# EAGLE board freetserv (EAGLE 7.5.0), part 1 of 2
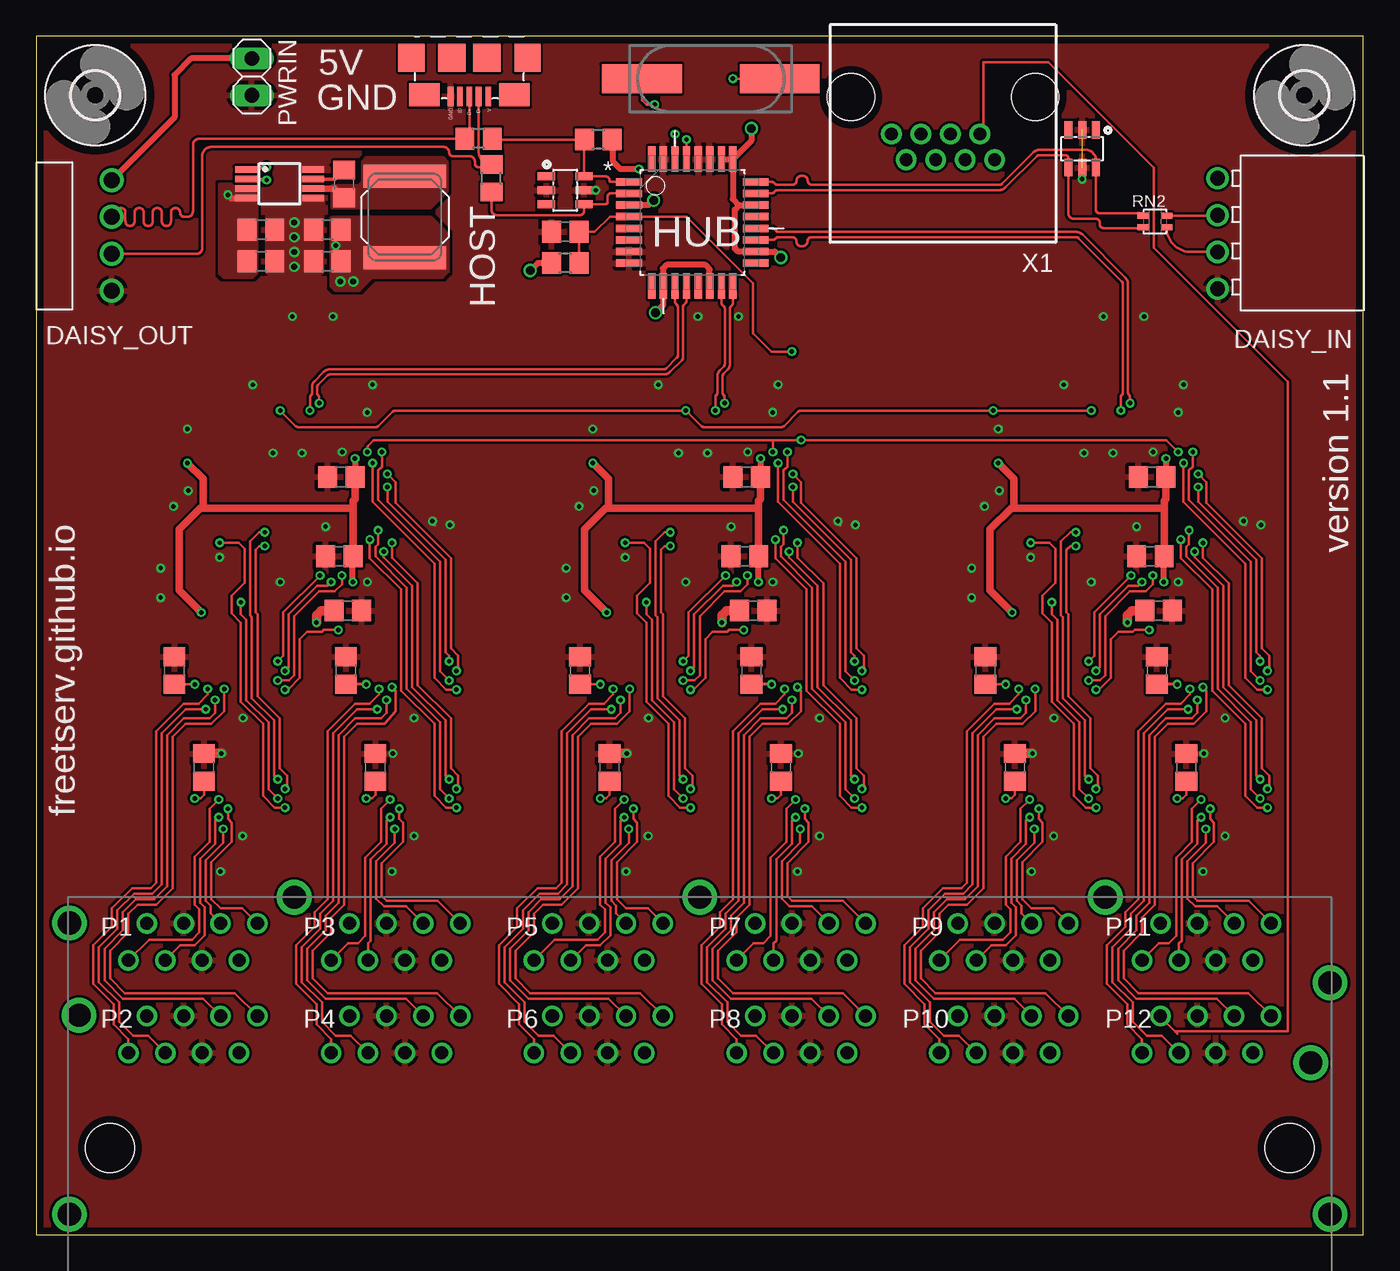
[diagram p7: board, top side]
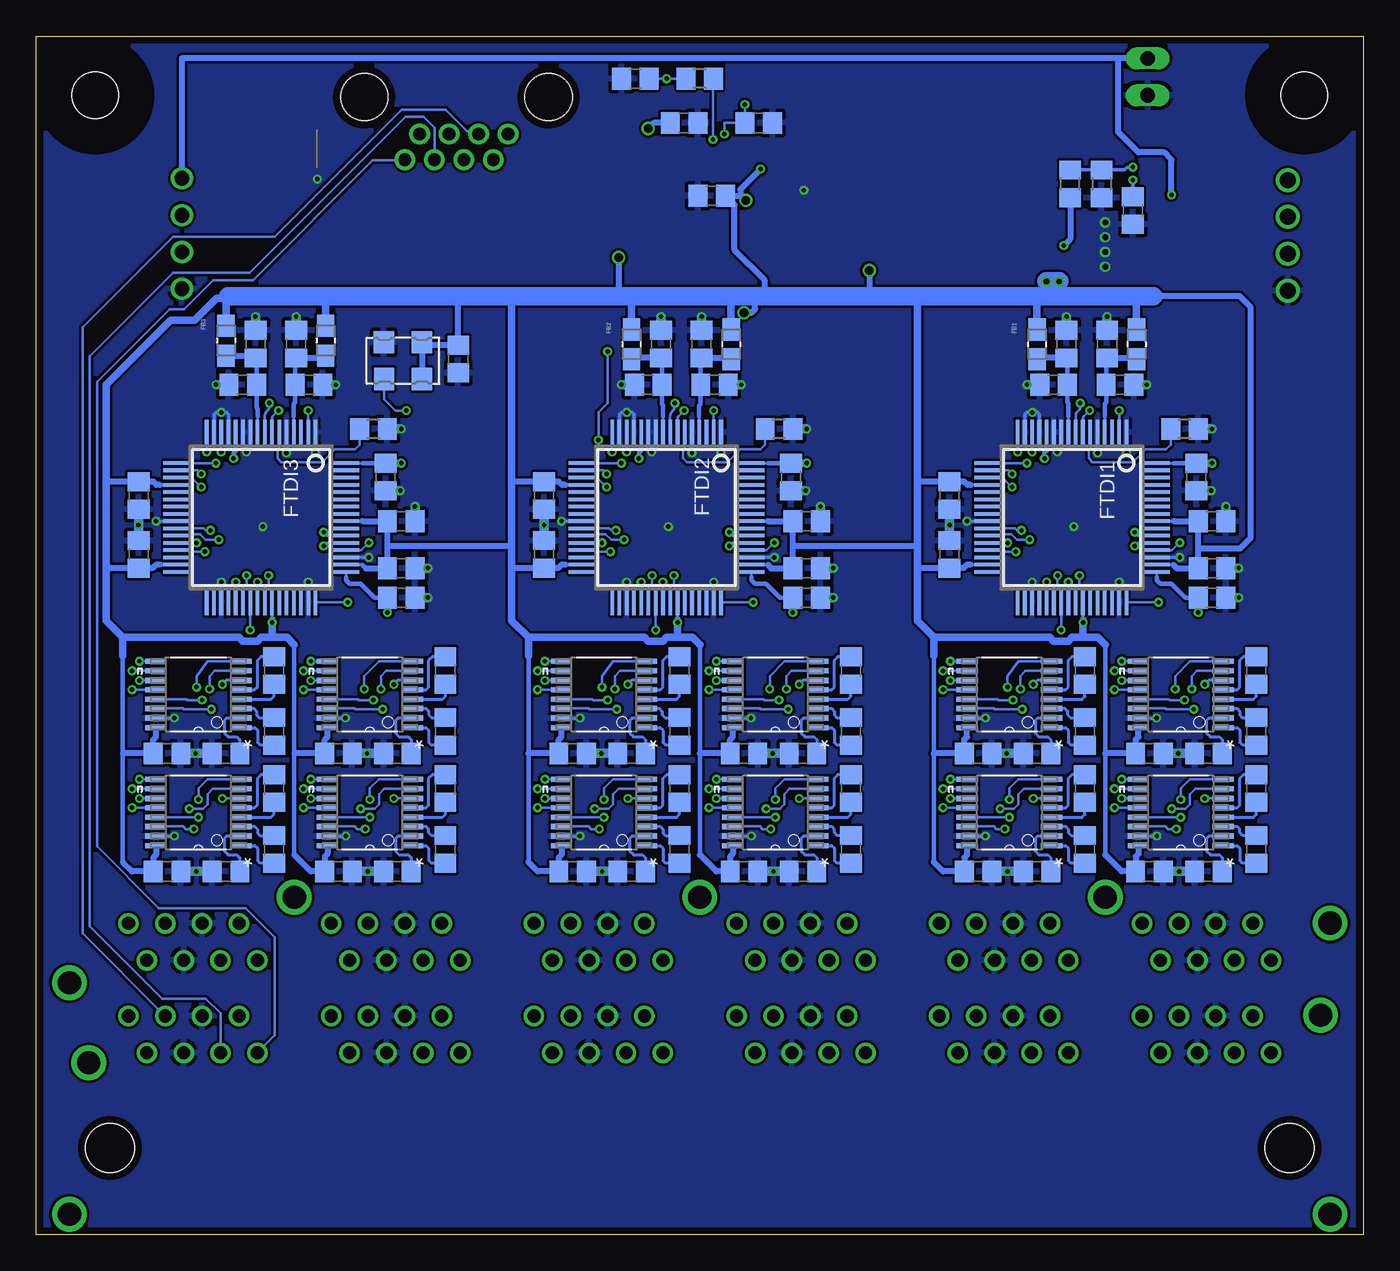
[diagram p8: board, bottom side, seen from below]

Size 91.44 x 82.55 mm. Coordinates in mm from the lower left corner, seen from the top.
Outline: 0,0 91.44,0 91.44,82.55 0,82.55 0,0
Copper layers (1*16): Top 0.035mm / dielectric 1.5mm / Bottom 0.035mm
Design rules "EagleRules": minimum track width 7mil, minimum drill 12mil, track to track 7mil, track to pad 7mil, pad to pad 7mil, via to via 7mil, smd to smd 0mil, copper to edge 20mil, drill to drill 10mil, minimum pad ring 10mil, minimum via ring 6mil, stop-mask expansion 2mil, vias tented up to drill 25mil, thermal gap 10mil
Net classes: 1 USB: width 0.178 mm, clearance 0.178 mm; 2 power: width 0.406 mm

## Footprints (pad centres in the part's own frame; a part is rotated, then mirrored left to right if it is on the bottom)
C0805 = smd 1.3 x 1.5: 1 -0.95,0; 2 0.95,0
SOT23-6 = smd 0.55 x 1.2: 1 -0.95,-1.3; 2 0,-1.3; 3 0.95,-1.3; 4 0.95,1.3; 5 0,1.3; 6 -0.95,1.3
613004143121 = drill 1.02: 1 0,0; 2 2.54,0; 3 5.08,0; 4 7.62,0
61300411021 = drill 1.1: 1 3.81,0; 2 1.27,0; 3 -1.27,0; 4 -3.81,0
WE-KI_0805A = smd 1.524 x 1.2: 1 -1.015,0; 2 1.041,0
LQFP64 = smd 0.25 x 1.778: 1 -3.75,-5.854; 2 -3.25,-5.854; 3 -2.75,-5.854; 4 -2.25,-5.854; 5 -1.75,-5.854; 6 -1.25,-5.854; 7 -0.75,-5.854; 8 -0.25,-5.854; 9 0.25,-5.854; 10 0.75,-5.854; 11 1.25,-5.854; 12 1.75,-5.854; 13 2.25,-5.854; 14 2.75,-5.854; 15 3.25,-5.854; 16 3.75,-5.854; 33 3.75,5.854; 34 3.25,5.854; 35 2.75,5.854; 36 2.25,5.854; 37 1.75,5.854; 38 1.25,5.854; 39 0.75,5.854; 40 0.25,5.854; 41 -0.25,5.854; 42 -0.75,5.854; 43 -1.25,5.854; 44 -1.75,5.854; 45 -2.25,5.854; 46 -2.75,5.854; 47 -3.25,5.854; 48 -3.75,5.854 | smd 1.778 x 0.25: 17 5.854,-3.75; 18 5.854,-3.25; 19 5.854,-2.75; 20 5.854,-2.25; 21 5.854,-1.75; 22 5.854,-1.25; 23 5.854,-0.75; 24 5.854,-0.25; 25 5.854,0.25; 26 5.854,0.75; 27 5.854,1.25; 28 5.854,1.75; 29 5.854,2.25; 30 5.854,2.75; 31 5.854,3.25; 32 5.854,3.75; 49 -5.854,3.75; 50 -5.854,3.25; 51 -5.854,2.75; 52 -5.854,2.25; 53 -5.854,1.75; 54 -5.854,1.25; 55 -5.854,0.75; 56 -5.854,0.25; 57 -5.854,-0.25; 58 -5.854,-0.75; 59 -5.854,-1.25; 60 -5.854,-1.75; 61 -5.854,-2.25; 62 -5.854,-2.75; 63 -5.854,-3.25; 64 -5.854,-3.75
3,2 = hole 3.2: 0,0
QFP80P900X900X145-32N = smd 1.778 x 0.508: 1 -4.369,2.794; 2 -4.369,2.007; 3 -4.369,1.194; 4 -4.369,0.406; 5 -4.369,-0.406; 6 -4.369,-1.194; 7 -4.369,-2.007; 8 -4.369,-2.794; 17 4.369,-2.794; 18 4.369,-2.007; 19 4.369,-1.194; 20 4.369,-0.406; 21 4.369,0.406; 22 4.369,1.194; 23 4.369,2.007; 24 4.369,2.794 | smd 0.508 x 1.778: 9 -2.794,-4.369; 10 -2.007,-4.369; 11 -1.194,-4.369; 12 -0.406,-4.369; 13 0.406,-4.369; 14 1.194,-4.369; 15 2.007,-4.369; 16 2.794,-4.369; 25 2.794,4.369; 26 2.007,4.369; 27 1.194,4.369; 28 0.406,4.369; 29 -0.406,4.369; 30 -1.194,4.369; 31 -2.007,4.369; 32 -2.794,4.369
MSOP8 = smd 0.45 x 1.524: 1 -0.975,-2.304; 2 -0.325,-2.304; 3 0.325,-2.304; 4 0.975,-2.304; 5 0.975,2.304; 6 0.325,2.304; 7 -0.325,2.304; 8 -0.975,2.304
SOP65P640X120-16N = smd 1.473 x 0.356: 1 -2.921,2.286; 2 -2.921,1.626; 3 -2.921,0.965; 4 -2.921,0.33; 5 -2.921,-0.33; 6 -2.921,-0.965; 7 -2.921,-1.626; 8 -2.921,-2.286; 9 2.921,-2.286; 10 2.921,-1.626; 11 2.921,-0.965; 12 2.921,-0.33; 13 2.921,0.33; 14 2.921,0.965; 15 2.921,1.626; 16 2.921,2.286
NR60XX = smd 1.6 x 5.7: 1 -2.8,0; 2 2.8,0
1X02 = drill 1.016 long: 1 -1.27,0; 2 1.27,0
CSM-7X-DU = smd 5.5 x 2: 1 -4.75,0; 2 4.75,0
XO53 = smd 1.4 x 1.524: 1 -1.3,-1.278; 2 1.325,-1.278; 3 1.3,1.252; 4 -1.3,1.252
R0805 = smd 1.3 x 1.5: 1 -0.95,0; 2 0.95,0
EXBV4V = smd 0.4 x 0.8: A1 -0.4,-0.8; A2 -0.4,0.8; B1 0.4,-0.8; B2 0.4,0.8
SS73100-046F = drill 1.6 pad 2.1: H1 -43.434,-4.572; H2 -42.774,9.144; H3 -43.434,15.494; H4 -27.94,17.272; H5 0,17.272; H6 27.94,17.272; H7 43.434,11.379; H8 42.113,5.867; H9 43.434,-4.572 | drill 0.9 pad 1.4: P1.1 -30.48,15.469; P1.2 -31.75,12.929; P1.3 -33.02,15.469; P1.4 -34.29,12.929; P1.5 -35.56,15.469; P1.6 -36.83,12.929; P1.7 -38.1,15.469; P1.8 -39.37,12.929; P2.1 -39.37,6.553; P2.2 -38.1,9.093; P2.3 -36.83,6.553; P2.4 -35.56,9.093; P2.5 -34.29,6.553; P2.6 -33.02,9.093; P2.7 -31.75,6.553; P2.8 -30.48,9.093; P3.1 -16.51,15.469; P3.2 -17.78,12.929; P3.3 -19.05,15.469; P3.4 -20.32,12.929; P3.5 -21.59,15.469; P3.6 -22.86,12.929; P3.7 -24.13,15.469; P3.8 -25.4,12.929; P4.1 -25.4,6.553; P4.2 -24.13,9.093; P4.3 -22.86,6.553; P4.4 -21.59,9.093; P4.5 -20.32,6.553; P4.6 -19.05,9.093; P4.7 -17.78,6.553; P4.8 -16.51,9.093; P5.1 -2.54,15.469; P5.2 -3.81,12.929; P5.3 -5.08,15.469; P5.4 -6.35,12.929; P5.5 -7.62,15.469; P5.6 -8.89,12.929; P5.7 -10.16,15.469; P5.8 -11.43,12.929; P6.1 -11.43,6.553; P6.2 -10.16,9.093; P6.3 -8.89,6.553; P6.4 -7.62,9.093; P6.5 -6.35,6.553; P6.6 -5.08,9.093; P6.7 -3.81,6.553; P6.8 -2.54,9.093; P7.1 11.43,15.469; P7.2 10.16,12.929; P7.3 8.89,15.469; P7.4 7.62,12.929; P7.5 6.35,15.469; P7.6 5.08,12.929; P7.7 3.81,15.469; P7.8 2.54,12.929; P8.1 2.54,6.553; P8.2 3.81,9.093; P8.3 5.08,6.553; P8.4 6.35,9.093; P8.5 7.62,6.553; P8.6 8.89,9.093; P8.7 10.16,6.553; P8.8 11.43,9.093; P9.1 25.4,15.469; P9.2 24.13,12.929; P9.3 22.86,15.469; P9.4 21.59,12.929; P9.5 20.32,15.469; P9.6 19.05,12.929; P9.7 17.78,15.469; P9.8 16.51,12.929; P10.1 16.51,6.553; P10.2 17.78,9.093; P10.3 19.05,6.553; P10.4 20.32,9.093; P10.5 21.59,6.553; P10.6 22.86,9.093; P10.7 24.13,6.553; P10.8 25.4,9.093; P11.1 39.37,15.469; P11.2 38.1,12.929; P11.3 36.83,15.469; P11.4 35.56,12.929; P11.5 34.29,15.469; P11.6 33.02,12.929; P11.7 31.75,15.469; P11.8 30.48,12.929; P12.1 30.48,6.553; P12.2 31.75,9.093; P12.3 33.02,6.553; P12.4 34.29,9.093; P12.5 35.56,6.553; P12.6 36.83,9.093; P12.7 38.1,6.553; P12.8 39.37,9.093 | hole 3.353: -40.64,0; 40.64,0
USB_MICROB_PACKAGE = smd 0.4 x 1.35: D+ 0,-0.68; D- -0.64,-0.68; GND 1.3,-0.68; ID 0.66,-0.68; V -1.3,-0.68 | smd 2.1 x 1.6: PAD1 -3.1,-0.8; PAD2 3.1,-0.8 | smd 1.8 x 1.9: PAD3 -4,-3.35; PAD6 4,-3.35 | smd 1.9 x 1.9: PAD4 -1.2,-3.35; PAD5 1.2,-3.35
0446200001 = drill 0.889 pad 1.422: 1 -3.556,4.318; 2 -2.54,2.54; 3 -1.524,4.318; 4 -0.508,2.54; 5 0.508,4.318; 6 1.524,2.54; 7 2.54,4.318; 8 3.556,2.54 | hole 3.251: 6.35,0; -6.35,0

## Placement (x,y rotation side)
C1  0.1uF  [C0805]  19.18,26.54 270 bottom
C2  10uF  [C0805]  15.49,69.22 0 top
C3  10uF  [C0805]  15.49,67.06 0 top
C4  0.1uF  [C0805]  21.21,72.39 270 top
C5  1uF  [C0805]  15.88,70.55 270 bottom
C6  10uF  [C0805]  20.07,69.22 180 top
C7  10uF  [C0805]  20.07,67.06 180 top
C8  3.3uF  [C0805]  10.41,43.88 180 bottom
C11  0.1uF  [C0805]  16.76,58.55 0 bottom
C12  0.1uF  [C0805]  21.34,58.55 180 bottom
C13  4.7uF  [C0805]  17.65,61.34 90 bottom
C14  4.7uF  [C0805]  20.45,61.34 90 bottom
C15  0.1uF  [C0805]  19.18,34.67 270 bottom
C16  0.1uF  [C0805]  19.18,38.86 270 bottom
C17  0.1uF  [C0805]  22.48,33.15 0 bottom
C18  0.1uF  [C0805]  21.34,38.86 270 top
C19  0.1uF  [C0805]  26.54,33.15 180 bottom
C20  18pF  [C0805]  41.66,76.58 180 bottom
C21  18pF  [C0805]  50.16,79.63 0 bottom
C22  0.1uF  [C0805]  19.18,30.73 270 bottom
C23  0.1uF  [C0805]  22.48,25.02 0 bottom
C24  0.1uF  [C0805]  23.37,32.19 270 top
C25  0.1uF  [C0805]  26.54,25.02 180 bottom
C26  0.1uF  [C0805]  7.37,34.67 270 bottom
C27  0.1uF  [C0805]  7.37,38.86 270 bottom
C28  0.1uF  [C0805]  10.67,33.15 0 bottom
C29  0.1uF  [C0805]  9.53,38.86 270 top
C30  0.1uF  [C0805]  14.73,33.15 180 bottom
C31  0.1uF  [C0805]  7.37,26.54 270 bottom
C32  0.1uF  [C0805]  7.37,30.73 270 bottom
C33  0.1uF  [C0805]  10.67,25.02 0 bottom
C34  0.1uF  [C0805]  11.56,32.19 270 top
C35  0.1uF  [C0805]  14.73,25.02 180 bottom
C36  0.1uF  [C0805]  46.8,76.58 180 bottom
C37  0.1uF  [C0805]  36.45,69.09 0 top
C38  0.1uF  [C0805]  21.02,52.2 180 top
C39  0.1uF  [C0805]  20.89,46.74 180 top
C40  0.1uF  [C0805]  11.49,52.2 270 bottom
C41  0.1uF  [C0805]  28.51,46.86 90 bottom
C42  0.1uF  [C0805]  28.51,50.93 270 bottom
C43  0.1uF  [C0805]  21.46,42.99 0 top
C44  0.1uF  [C0805]  10.41,49.15 0 bottom
C45  0.1uF  [C0805]  10.41,45.91 0 bottom
C46  0.1uF  [C0805]  44.89,71.56 0 bottom
C47  0.1uF  [C0805]  62.36,60.33 90 bottom
C53  4.7uF  [C0805]  48.39,61.34 90 bottom
C54  0.1uF  [C0805]  47.12,34.67 270 bottom
C55  0.1uF  [C0805]  47.12,38.86 270 bottom
C56  0.1uF  [C0805]  50.42,33.15 0 bottom
C57  0.1uF  [C0805]  49.28,38.86 270 top
C58  0.1uF  [C0805]  54.48,33.15 180 bottom
C59  0.1uF  [C0805]  48.96,52.2 180 top
C60  0.1uF  [C0805]  48.83,46.74 180 top
C61  0.1uF  [C0805]  39.43,52.2 270 bottom
C62  0.1uF  [C0805]  56.45,46.86 90 bottom
C63  0.1uF  [C0805]  56.45,50.93 270 bottom
C64  0.1uF  [C0805]  49.4,42.99 0 top
C65  0.1uF  [C0805]  38.35,49.15 0 bottom
C66  0.1uF  [C0805]  38.35,45.91 0 bottom
C67  0.1uF  [C0805]  47.12,26.54 270 bottom
C68  0.1uF  [C0805]  47.12,30.73 270 bottom
C69  0.1uF  [C0805]  50.42,25.02 0 bottom
C70  0.1uF  [C0805]  51.31,32.19 270 top
C71  0.1uF  [C0805]  54.48,25.02 180 bottom
C72  0.1uF  [C0805]  35.31,34.67 270 bottom
C73  0.1uF  [C0805]  35.31,38.86 270 bottom
C74  0.1uF  [C0805]  38.61,33.15 0 bottom
C75  0.1uF  [C0805]  37.47,38.86 270 top
C76  0.1uF  [C0805]  42.67,33.15 180 bottom
C77  0.1uF  [C0805]  35.31,26.54 270 bottom
C78  0.1uF  [C0805]  35.31,30.73 270 bottom
C79  0.1uF  [C0805]  38.61,25.02 0 bottom
C80  0.1uF  [C0805]  39.5,32.19 270 top
C81  0.1uF  [C0805]  42.67,25.02 180 bottom
C89  0.1uF  [C0805]  75.06,34.67 270 bottom
C90  0.1uF  [C0805]  75.06,38.86 270 bottom
C91  0.1uF  [C0805]  78.36,33.15 0 bottom
C92  0.1uF  [C0805]  77.22,38.86 270 top
C93  0.1uF  [C0805]  82.42,33.15 180 bottom
C94  0.1uF  [C0805]  76.9,52.2 180 top
C95  0.1uF  [C0805]  76.77,46.74 180 top
C96  0.1uF  [C0805]  67.37,52.2 270 bottom
C97  0.1uF  [C0805]  84.39,46.86 90 bottom
C98  0.1uF  [C0805]  84.39,50.93 270 bottom
C99  0.1uF  [C0805]  77.34,42.99 0 top
C100  0.1uF  [C0805]  66.29,49.15 0 bottom
C101  0.1uF  [C0805]  66.29,45.91 0 bottom
C102  0.1uF  [C0805]  75.06,26.54 270 bottom
C103  0.1uF  [C0805]  75.06,30.73 270 bottom
C104  0.1uF  [C0805]  78.36,25.02 0 bottom
C105  0.1uF  [C0805]  79.25,32.19 270 top
C106  0.1uF  [C0805]  82.42,25.02 180 bottom
C107  0.1uF  [C0805]  63.25,34.67 270 bottom
C108  0.1uF  [C0805]  63.25,38.86 270 bottom
C109  0.1uF  [C0805]  66.55,33.15 0 bottom
C110  0.1uF  [C0805]  65.41,38.86 270 top
C111  0.1uF  [C0805]  70.61,33.15 180 bottom
C112  0.1uF  [C0805]  63.25,26.54 270 bottom
C113  0.1uF  [C0805]  63.25,30.73 270 bottom
C114  0.1uF  [C0805]  66.55,25.02 0 bottom
C115  0.1uF  [C0805]  67.44,32.19 270 top
C116  0.1uF  [C0805]  70.61,25.02 180 bottom
C489  0.1uF  [C0805]  44.7,58.55 0 bottom
C502  4.7uF  [C0805]  45.59,61.34 90 bottom
C519  0.1uF  [C0805]  49.28,58.55 180 bottom
C629  3.3uF  [C0805]  38.35,43.88 180 bottom
C829  3.3uF  [C0805]  66.29,43.88 180 bottom
C859  0.1uF  [C0805]  72.64,58.55 0 bottom
C869  0.1uF  [C0805]  77.22,58.55 180 bottom
C879  4.7uF  [C0805]  73.53,61.34 90 bottom
C889  4.7uF  [C0805]  76.33,61.34 90 bottom
D1  SN65220  [SOT23-6]  36.45,71.95 270 top
D2  SN65220  [SOT23-6]  72.07,74.8 180 top
DAISY_IN  613004143121  [613004143121]  81.41,72.77 270 top
DAISY_OUT  61300411021  [61300411021]  5.21,68.83 90 top
FB1  330  [WE-KI_0805A]  22.48,61.34 270 bottom
FB2  330  [WE-KI_0805A]  50.42,61.34 270 bottom
FB2\  330  [WE-KI_0805A]  15.62,61.34 270 bottom
FB2\1  330  [WE-KI_0805A]  43.56,61.34 270 bottom
FB2\2  330  [WE-KI_0805A]  71.5,61.59 270 bottom
FB3  330  [WE-KI_0805A]  78.36,61.59 270 bottom
FTDI1  FT4232HL  [LQFP64]  20.07,49.4 180 bottom
FTDI2  FT4232HL  [LQFP64]  48.01,49.4 180 bottom
FTDI3  FT4232HL  [LQFP64]  75.95,49.4 180 bottom
H1  MOUNT-HOLE3.2  [3,2]  4.06,78.49 0 top
H2  MOUNT-HOLE3.2  [3,2]  87.38,78.49 0 top
HUB  TUSB2046BVF  [QFP80P900X900X145-32N]  45.21,69.72 0 top
IC1  MCP16311  [MSOP8]  16.76,72.39 270 top
IC5  3232  [SOP65P640X120-16N]  24.38,37.21 180 bottom
IC6  3232  [SOP65P640X120-16N]  24.38,29.08 180 bottom
IC7  3232  [SOP65P640X120-16N]  12.57,37.21 180 bottom
IC8  3232  [SOP65P640X120-16N]  12.57,29.08 180 bottom
IC10  3232  [SOP65P640X120-16N]  52.32,37.21 180 bottom
IC11  3232  [SOP65P640X120-16N]  52.32,29.08 180 bottom
IC12  3232  [SOP65P640X120-16N]  40.51,37.21 180 bottom
IC13  3232  [SOP65P640X120-16N]  40.51,29.08 180 bottom
IC15  3232  [SOP65P640X120-16N]  80.26,37.21 180 bottom
IC16  3232  [SOP65P640X120-16N]  80.26,29.08 180 bottom
IC17  3232  [SOP65P640X120-16N]  68.45,37.21 180 bottom
IC18  3232  [SOP65P640X120-16N]  68.45,29.08 180 bottom
L3  15uH  [NR60XX]  25.4,70.1 270 top
PWRIN  [1X02]  14.86,79.76 270 top
Q2  6MHz  [CSM-7X-DU]  46.48,79.63 0 top
QG1  ASFL1-12.000  [XO53]  66.17,60.2 180 bottom
R1  27  [R0805]  31.37,72.77 90 top
R2  12K/1%  [R0805]  12.32,55.5 180 bottom
R3  1.5K  [R0805]  45.72,79.63 180 bottom
R4  31.6k  [R0805]  20.19,72.39 90 bottom
R5  10k  [R0805]  18.03,72.39 270 bottom
R6  1.5K  [R0805]  38.73,75.44 180 top
R7  22K  [R0805]  36.45,66.93 180 top
R8  27  [R0805]  30.48,75.5 180 top
R13  12K/1%  [R0805]  40.26,55.5 180 bottom
R15  12K/1%  [R0805]  68.2,55.5 180 bottom
RN2  27  [EXBV4V]  77.09,69.79 270 top
U$1  SS73100-046F_DWG  [SS73100-046F]  45.72,5.97 0 top
USB_HOST  USB_MICROB  [USB_MICROB_PACKAGE]  29.84,77.72 180 top
X1  0446200001  [0446200001]  62.48,78.36 180 top